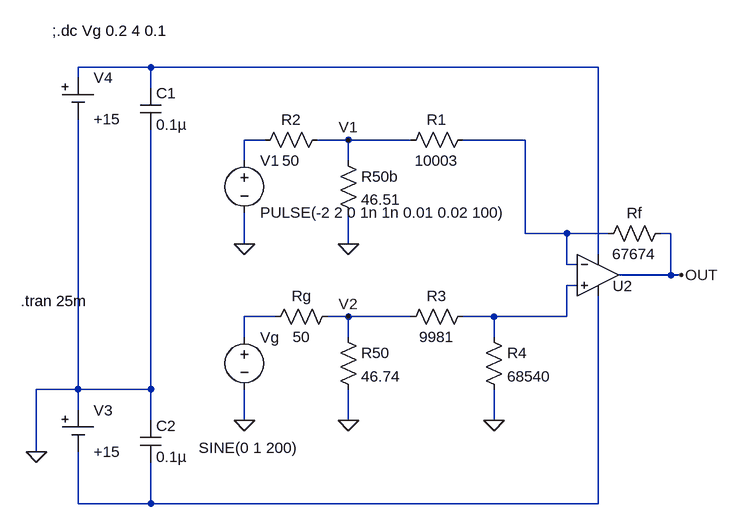
[diagram p0: schematic Circuito4_diff.asc]
Circuito4_diff.asc, the LTspice schematic file:
Version 4
SHEET 1 880 680
WIRE -160 -16 -272 -16
WIRE 528 -16 -160 -16
WIRE -272 0 -272 -16
WIRE -160 16 -160 -16
WIRE 16 96 -16 96
WIRE 144 96 96 96
WIRE 240 96 144 96
WIRE 416 96 320 96
WIRE -16 128 -16 96
WIRE 144 128 144 96
WIRE 416 240 416 96
WIRE 480 240 416 240
WIRE 544 240 480 240
WIRE 640 240 624 240
WIRE -16 256 -16 208
WIRE 144 256 144 208
WIRE 528 272 528 -16
WIRE 480 288 480 240
WIRE 496 288 480 288
WIRE 640 304 640 240
WIRE 640 304 560 304
WIRE 656 304 640 304
WIRE 496 320 480 320
WIRE 32 368 -16 368
WIRE 144 368 112 368
WIRE 240 368 144 368
WIRE 368 368 320 368
WIRE 480 368 480 320
WIRE 480 368 368 368
WIRE -16 400 -16 368
WIRE 144 400 144 368
WIRE 368 400 368 368
WIRE -272 480 -272 64
WIRE -272 480 -336 480
WIRE -160 480 -160 80
WIRE -160 480 -272 480
WIRE -272 512 -272 480
WIRE -160 528 -160 480
WIRE -16 528 -16 480
WIRE 144 528 144 480
WIRE 368 528 368 480
WIRE -336 576 -336 480
WIRE -272 656 -272 576
WIRE -160 656 -160 592
WIRE -160 656 -272 656
WIRE 528 656 528 336
WIRE 528 656 -160 656
FLAG -16 256 0
FLAG 144 256 0
FLAG -336 576 0
FLAG 144 96 V1
FLAG 656 304 OUT
FLAG -16 528 0
FLAG 144 528 0
FLAG 144 368 V2
FLAG 368 528 0
SYMBOL cap -176 528 R0
SYMATTR InstName C2
SYMATTR Value 0.1µ
SYMBOL Misc\\cell -272 512 R0
WINDOW 123 0 0 Left 0
WINDOW 39 0 0 Left 0
SYMATTR InstName V3
SYMATTR Value +15
SYMBOL Misc\\cell -272 0 R0
WINDOW 123 0 0 Left 0
WINDOW 39 0 0 Left 0
SYMATTR InstName V4
SYMATTR Value +15
SYMBOL res 224 112 R270
WINDOW 0 32 56 VTop 2
WINDOW 3 0 56 VBottom 2
SYMATTR InstName R1
SYMATTR Value 10003
SYMBOL res 640 224 R90
WINDOW 0 0 56 VBottom 2
WINDOW 3 32 56 VTop 2
SYMATTR InstName Rf
SYMATTR Value 67674
SYMBOL res 128 112 R0
SYMATTR InstName R50b
SYMATTR Value 46.51
SYMBOL cap -176 16 R0
SYMATTR InstName C1
SYMATTR Value 0.1µ
SYMBOL Opamps/UniversalOpamp2 528 304 R0
WINDOW 0 23 17 Left 2
SYMATTR InstName U2
SYMBOL res 128 352 R90
WINDOW 0 0 56 VBottom 2
WINDOW 3 32 56 VTop 2
SYMATTR InstName Rg
SYMATTR Value 50
SYMBOL res 224 384 R270
WINDOW 0 32 56 VTop 2
WINDOW 3 0 56 VBottom 2
SYMATTR InstName R3
SYMATTR Value 9981
SYMBOL voltage -16 384 R0
WINDOW 3 -70 186 Left 2
WINDOW 123 0 0 Left 0
WINDOW 39 0 0 Left 0
SYMATTR Value SINE(0 1 200)
SYMATTR InstName Vg
SYMBOL res 128 384 R0
SYMATTR InstName R50
SYMATTR Value 46.74
SYMBOL res 352 384 R0
SYMATTR InstName R4
SYMATTR Value 68540
SYMBOL voltage -16 112 R0
WINDOW 123 0 0 Left 0
WINDOW 39 0 0 Left 0
SYMATTR InstName V1
SYMATTR Value PULSE(-2 2 0 1n 1n 0.01 0.02 100)
SYMBOL res 112 80 R90
WINDOW 0 0 56 VBottom 2
WINDOW 3 32 56 VTop 2
SYMATTR InstName R2
SYMATTR Value 50
TEXT -360 344 Left 2 !.tran 25m
TEXT -312 -72 Left 2 !;.dc Vg 0.2 4 0.1

The netlist it stands for:
* Circuito4_diff.asc
C2 0 N006 0.1µ
V3 0 N006 +15
V4 N001 0 +15
R1 V1 N003 10003
Rf OUT N003 67674
R50b V1 0 46.51
C1 N001 0 0.1µ
XU2 N004 N003 N001 N006 OUT level.2 Avol=1Meg GBW=10Meg Slew=10Meg ilimit=25m rail=0 Vos=0 phimargin=45 en=0 enk=0 in=0 ink=0 Rin=500Meg  ; pins IN+ IN- V+ V- OUT
Rg V2 N005 50
R3 V2 N004 9981
Vg N005 0 SINE(0 1 200)
R50 V2 0 46.74
R4 N004 0 68540
V1 N002 0 PULSE(-2 2 0 1n 1n 0.01 0.02 100)
R2 V1 N002 50
.tran 25m
;.dc Vg 0.2 4 0.1
.lib UniversalOpamps2.sub
.backanno
.end